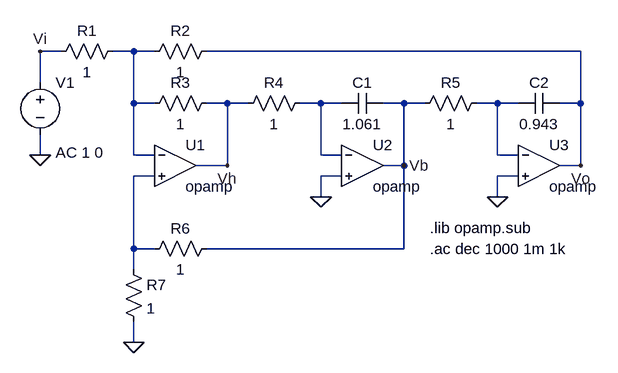
[diagram p0: schematic SOS2_KHN.asc]
SOS2_KHN.asc, the LTspice schematic file:
Version 4.1
SHEET 1 920 680
WIRE 16 80 -16 80
WIRE 128 80 96 80
WIRE 160 80 128 80
WIRE 816 80 240 80
WIRE -16 128 -16 80
WIRE 128 160 128 80
WIRE 160 160 128 160
WIRE 272 160 240 160
WIRE 304 160 272 160
WIRE 416 160 384 160
WIRE 448 160 416 160
WIRE 544 160 512 160
WIRE 576 160 544 160
WIRE 688 160 656 160
WIRE 720 160 688 160
WIRE 816 160 816 80
WIRE 816 160 784 160
WIRE -16 240 -16 208
WIRE 128 240 128 160
WIRE 160 240 128 240
WIRE 416 240 416 160
WIRE 448 240 416 240
WIRE 688 240 688 160
WIRE 720 240 688 240
WIRE 272 256 272 160
WIRE 272 256 224 256
WIRE 544 256 544 160
WIRE 544 256 512 256
WIRE 816 256 816 160
WIRE 816 256 784 256
WIRE 160 272 128 272
WIRE 448 272 416 272
WIRE 720 272 688 272
WIRE 416 304 416 272
WIRE 688 304 688 272
WIRE 128 384 128 272
WIRE 160 384 128 384
WIRE 544 384 544 256
WIRE 544 384 240 384
WIRE 128 416 128 384
WIRE 128 528 128 496
FLAG -16 240 0
FLAG 416 304 0
FLAG 688 304 0
FLAG 128 528 0
FLAG 544 256 Vb
FLAG 272 256 Vh
FLAG 816 256 Vo
FLAG -16 80 Vi
SYMBOL voltage -16 112 R0
WINDOW 123 24 124 Left 2
WINDOW 39 0 0 Left 0
SYMATTR InstName V1
SYMATTR Value ""
SYMATTR Value2 AC 1 0
SYMBOL res 112 64 R90
WINDOW 0 0 56 VBottom 2
WINDOW 3 32 56 VTop 2
SYMATTR InstName R1
SYMATTR Value 1
SYMBOL res 256 64 R90
WINDOW 0 0 56 VBottom 2
WINDOW 3 32 56 VTop 2
SYMATTR InstName R2
SYMATTR Value 1
SYMBOL res 256 144 R90
WINDOW 0 0 56 VBottom 2
WINDOW 3 32 56 VTop 2
SYMATTR InstName R3
SYMATTR Value 1
SYMBOL res 400 144 R90
WINDOW 0 0 56 VBottom 2
WINDOW 3 32 56 VTop 2
SYMATTR InstName R4
SYMATTR Value 1
SYMBOL cap 512 144 R90
WINDOW 0 0 32 VBottom 2
WINDOW 3 32 32 VTop 2
SYMATTR InstName C1
SYMATTR Value 1.061
SYMBOL res 672 144 R90
WINDOW 0 0 56 VBottom 2
WINDOW 3 32 56 VTop 2
SYMATTR InstName R5
SYMATTR Value 1
SYMBOL cap 784 144 R90
WINDOW 0 0 32 VBottom 2
WINDOW 3 32 32 VTop 2
SYMATTR InstName C2
SYMATTR Value 0.943
SYMBOL res 256 368 R90
WINDOW 0 0 56 VBottom 2
WINDOW 3 32 56 VTop 2
SYMATTR InstName R6
SYMATTR Value 1
SYMBOL res 112 400 R0
SYMATTR InstName R7
SYMATTR Value 1
SYMBOL OpAmps\\opamp 192 192 R0
SYMATTR InstName U1
SYMBOL OpAmps\\opamp 480 192 R0
SYMATTR InstName U2
SYMBOL OpAmps\\opamp 752 192 R0
SYMATTR InstName U3
TEXT 584 352 Left 2 !.lib opamp.sub
TEXT 584 384 Left 2 !.ac dec 1000 1m 1k

The netlist it stands for:
* SOS2_KHN.asc
V1 Vi 0 AC 1 0
R1 N001 Vi 1
R2 Vo N001 1
R3 Vh N001 1
R4 N002 Vh 1
C1 Vb N002 1.061
R5 N003 Vb 1
C2 Vo N003 0.943
R6 Vb N004 1
R7 N004 0 1
X§U1 N001 N004 Vh opamp Aol=100K GBW=10Meg  ; pins invin noninvin out
X§U2 N002 0 Vb opamp Aol=100K GBW=10Meg  ; pins invin noninvin out
X§U3 N003 0 Vo opamp Aol=100K GBW=10Meg  ; pins invin noninvin out
.lib opamp.sub
.ac dec 1000 1m 1k
.backanno
.end

* Results of the author's LTspice run, read from the files saved beside the schematic
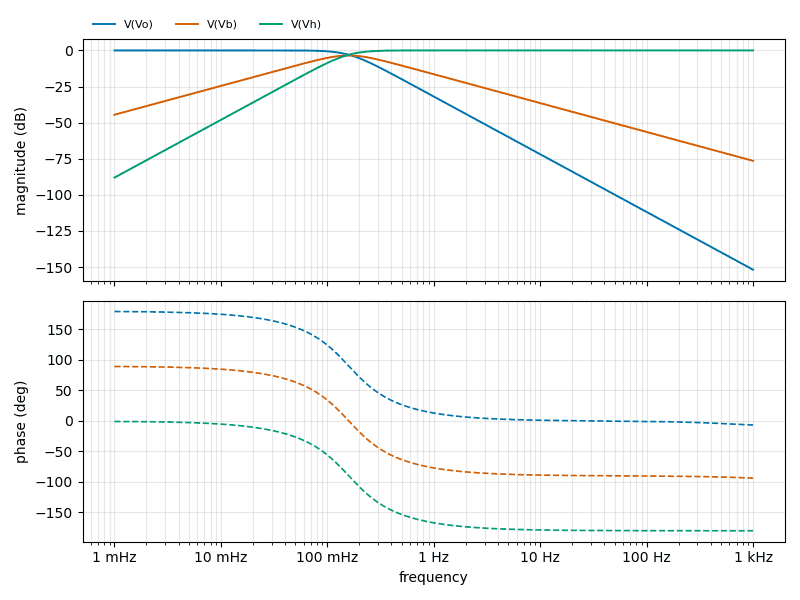
[diagram p1: AC Analysis of SOS2_KHN.asc, plotted from the saved traces]
* AC Analysis, 1 run:
*   V(Vo): -0.00 dB at 1 mHz, -151.82 dB at 1 kHz, peak -0.00 dB at 2.104 mHz, 3 dB below the peak at 159.1 mHz
*   V(Vb): -44.55 dB at 1 mHz, -76.46 dB at 1 kHz, peak -3.52 dB at 159.2 mHz, 3 dB below the peak at 82.36 mHz and 307.4 mHz
*   V(Vh): -88.07 dB at 1 mHz, -0.00 dB at 1 kHz, peak -0.00 dB at 12.05 Hz, 3 dB below the peak at 159.1 mHz